# EAGLE schematic nocte-lux (EAGLE 6.3)
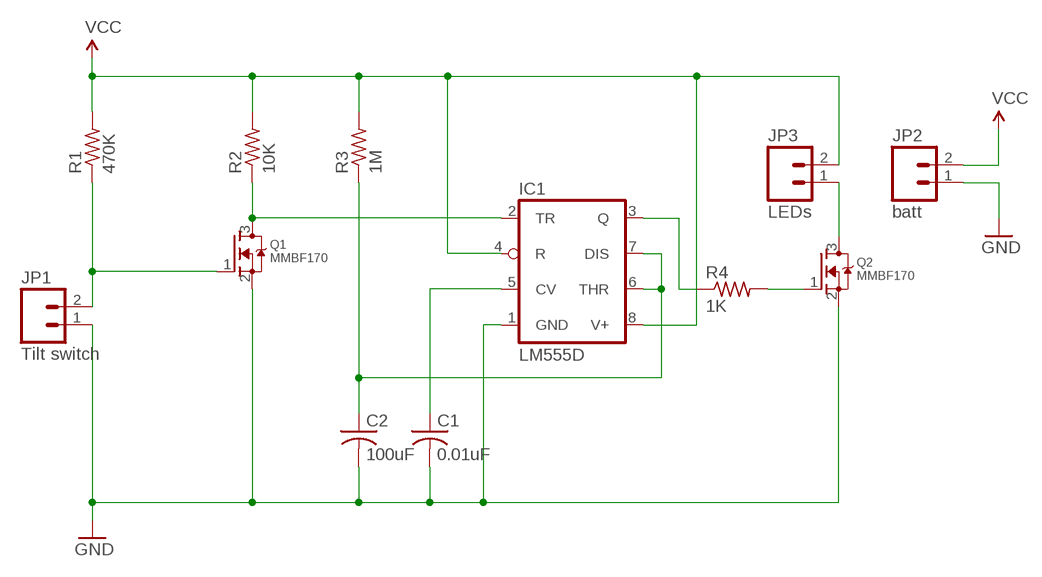
[diagram p0: schematic, sheet 1]

## Parts
C1  0.01uF  C-USC1206  [C1206]
C2  100uF  C-USC1206  [C1206]
IC1  LM555D  [SO08]
JP1  Tilt switch  M02PTH  [1X02]
JP2  batt  M02PTH  [1X02]
JP3  LEDs  M02PTH  [1X02]
Q1  MMBF170  MOSFET-NWAVE  [SOT23-W]
Q2  MMBF170  MOSFET-NWAVE  [SOT23-W]
R1  470K  R-US_M1206  [M1206]
R2  10K  R-US_M1206  [M1206]
R3  1M  R-US_M1206  [M1206]
R4  1K  R-US_M1206  [M1206]

## Nets
GND: C1.2 C2.2 IC1.1(GND) JP1.1 JP2.1 Q1.2(S) Q2.2(S)
N$1: JP1.2 Q1.1(G) R1.1
N$2: JP3.1 Q2.3(D)
N$3: IC1.2(TR) Q1.3(D) R2.1
N$5: C1.1 IC1.5(CV)
N$6: Q2.1(G) R4.2
N$7: IC1.3(Q) R4.1
N$8: C2.1 IC1.6(THR) IC1.7(DIS) R3.1
VCC: IC1.4(R) IC1.8(V+) JP2.2 JP3.2 R1.2 R2.2 R3.2

## Library data of the parts
C1 C2 = adafruit:C-US: CAPACITOR, American symbol
IC1 = adafruit:*555: TIMER Changed DIP package to have round (not oval) pin pads http://www.ladyada.net/library/pcb/eaglelibrary.html
JP1-JP3 = SparkFun-Connectors:M02: Header 2 Standard 2-pin 0.1" header. Use with straight break away headers (SKU : PRT-00116), right angle break away headers (PRT-00553), swiss pins (PRT-00743), machine pins (PRT-00117), and female headers (PRT-00115). Molex polarized connector foot print use with SKU : PRT-08233 with associated crimp pins and housings.
Q1 Q2 = adafruit:MOSFET-N: N-Channel Mosfet 2N7002E - 60V 260mA SOT23 [Digikey: 2N7002ET1GOSTR-ND] - REEL BSH103 - 30V 850mA SOT23 [Digikey: 568-5013-1-ND]
R1-R4 = adafruit:R-US_: RESISTOR, American symbol